# Altium project CAN_UART_MODUL.PrjPcb
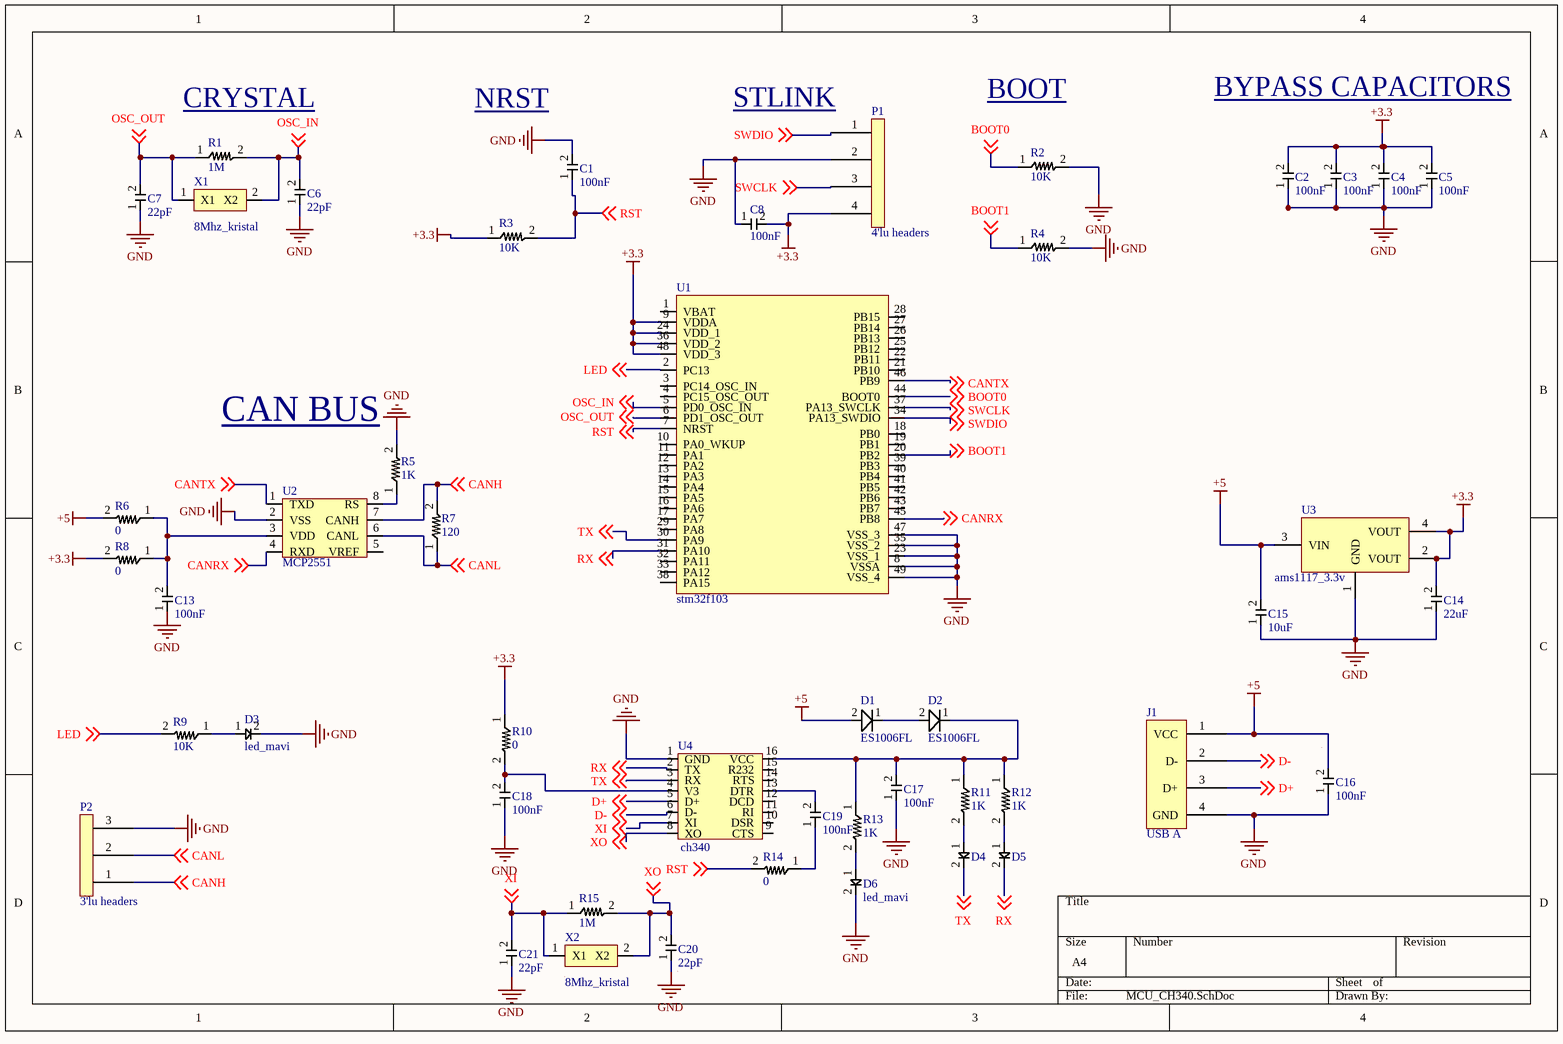
[diagram p0: MCU_CH340.SchDoc]
1 sheet, 47 parts. Net scope: global (net labels, ports and power ports of the same name join across sheets).
Board file: PCB2.PcbDoc

## Sheet MCU_CH340.SchDoc
size A4; SheetNumber: 1; SheetTotal: 1

### Parts
C1  100nF  [0805_CAP]
C2  100nF  [0805_CAP]
C3  100nF  [0805_CAP]
C4  100nF  [0805_CAP]
C5  100nF  [0805_CAP]
C6  22pF  [0805_CAP]
C7  22pF  [0805_CAP]
C8  100nF  [0805_CAP]
C13  100nF  [0805_CAP]
C14  22uF  [0805_CAP]
C15  10uF  [0805_CAP]
C16  100nF  [0805_CAP]
C17  100nF  [0805_CAP]
C18  100nF  [0805_CAP]
C19  100nF  [0805_CAP]
C20  22pF  [0805_CAP]
C21  22pF  [0805_CAP]
D1  ES1006FL  [ES1006FL]
D2  ES1006FL  [ES1006FL]
D3  led_mavi  [led]
D4  (no value)  [led]
D5  (no value)  [led]
D6  led_mavi  [led]
J1  USB A  [USB A]
P1  4'lu headers  [4'lu headers]
P2  3'lu headers  [3'lu headers]
R1  1M  [res_0805]
R2  10K  [res_0805]
R3  10K  [res_0805]
R4  10K  [res_0805]
R5  1K  [res_0805]
R6  0  [res_0805]
R7  120  [res_0805]
R8  0  [res_0805]
R9  10K  [res_0805]
R10  0  [res_0805]
R11  1K  [res_0805]
R12  1K  [res_0805]
R13  1K  [res_0805]
R14  0  [res_0805]
R15  1M  [res_0805]
U1  stm32f103  [STM32F103C6T8]
U2  MCP2551  [SOIC-8]
U3  ams1117_3.3v  [ams1117]
U4  ch340  [CH340 SOIC16]
X1  8Mhz_kristal  [8mhz_kristal]
X2  8Mhz_kristal  [8mhz_kristal]

### Nets
+3.3: C2.2 C3.2 C4.2 C5.2 C8.2 C14.2 P1.4 R3.1 R8.2 R10.1 U1.9(VDDA) U1.24(VDD_1) U1.36(VDD_2) U1.48(VDD_3) U3.2(VOUT) U3.4(VOUT)
+5: C15.2 C16.2 D1.2 J1.1(VCC) R6.2 U3.3(VIN)
GND: C1.2 C2.1 C3.1 C4.1 C5.1 C6.1 C7.1 C8.1 C13.1 C14.1 C15.1 C16.1 C17.1 C18.1 C20.1 C21.1 D3.2 D6.2 J1.4(GND) P1.2 P2.3 R2.2 R4.2 R5.2 U1.8(VSSA) U1.23(VSS_1) U1.35(VSS_2) U1.47(VSS_3) U1.49(VSS_4) U2.2(VSS) U3.1(GND) U4.1(GND)
BOOT0: R2.1 U1.44(BOOT0) ; off-sheet BOOT0
BOOT1: R4.1 U1.20(PB2) ; off-sheet BOOT1
CANH: P2.1 R7.2 U2.7(CANH) ; off-sheet CANH
CANL: P2.2 R7.1 U2.6(CANL) ; off-sheet CANL
CANRX: U1.45(PB8) U2.4(RXD) ; off-sheet CANRX
CANTX: U1.46(PB9) U2.1(TXD) ; off-sheet CANTX
D+: J1.3(D+) U4.5(D+) ; off-sheet D+
D-: J1.2(D-) U4.6(D-) ; off-sheet D-
LED: R9.2 U1.2(PC13) ; off-sheet LED
OSC_IN: C6.2 R1.2 U1.5(PD0_OSC_IN) X1.2(X2) ; off-sheet OSC_IN
OSC_OUT: C7.2 R1.1 U1.6(PD1_OSC_OUT) X1.1(X1) ; off-sheet OSC_OUT
RST: C1.1 R3.2 R14.2 U1.7(NRST) ; off-sheet RST
RX: D5.2 U1.31(PA10) U4.2(TX) ; off-sheet RX
SWCLK: P1.3 U1.37(PA13_SWCLK) ; off-sheet SWCLK
SWDIO: P1.1 U1.34(PA13_SWDIO) ; off-sheet SWDIO
TX: D4.2 U1.30(PA9) U4.3(RX) ; off-sheet TX
XI: C21.2 R15.1 U4.7(XI) X2.1(X1) ; off-sheet XI
XO: C20.2 R15.2 U4.8(XO) X2.2(X2) ; off-sheet XO
NetC13_2: C13.2 R6.1 R8.1 U2.3(VDD)
NetC17_2: C17.2 D2.1 R11.1 R12.1 R13.1 U4.16(VCC)
NetC18_2: C18.2 R10.2 U4.4(V3)
NetC19_1: C19.1 R14.1
NetC19_2: C19.2 U4.13(DTR)
NetD1_1: D1.1 D2.2
NetD3_1: D3.1 R9.1
NetD4_1: D4.1 R11.2
NetD5_1: D5.1 R12.2
NetD6_1: D6.1 R13.2
NetR5_1: R5.1 U2.8(RS)

Not connected (* = marked no-connect by the designer): U1 1(VBAT) 3(PC14_OSC_IN) 4(PC15_OSC_OUT) 10(PA0_WKUP) 11(PA1) 12(PA2) 13(PA3) 14(PA4) 15(PA5) 16(PA6) 17(PA7) 18(PB0) 19(PB1) 21(PB10) 22(PB11) 25(PB12) 26(PB13) 27(PB14) 28(PB15) 29(PA8) 32(PA11) 33(PA12) 38(PA15) 39(PB3) 40(PB4) 41(PB5) 42(PB6) 43(PB7); U2 5(VREF); U4 9(CTS) 10(DSR) 11(RI) 12(DCD) 14(RTS) 15(R232)

### Notes on the sheet
- (near R1) CRYSTAL
- NRST
- STLINK
- BOOT
- BYPASS CAPACITORS
- CAN BUS

### Library data of the parts
C1-C8 C13-C21 = 0805_CAP: 0805 CAPACITOR
D1 D2 = ES1006FL: ES1006FL 1A 600V Diyot Fred Ultra Hızlı
D3-D6 = led_mavi: 0805 mavi led
R1-R15 = 0805_RES: 0805
U1 = stm32f103: STM MCU
U2 = MCP2551: SOIC-8
X1 X2 = 8Mhz_kristal: 2 pin kristal